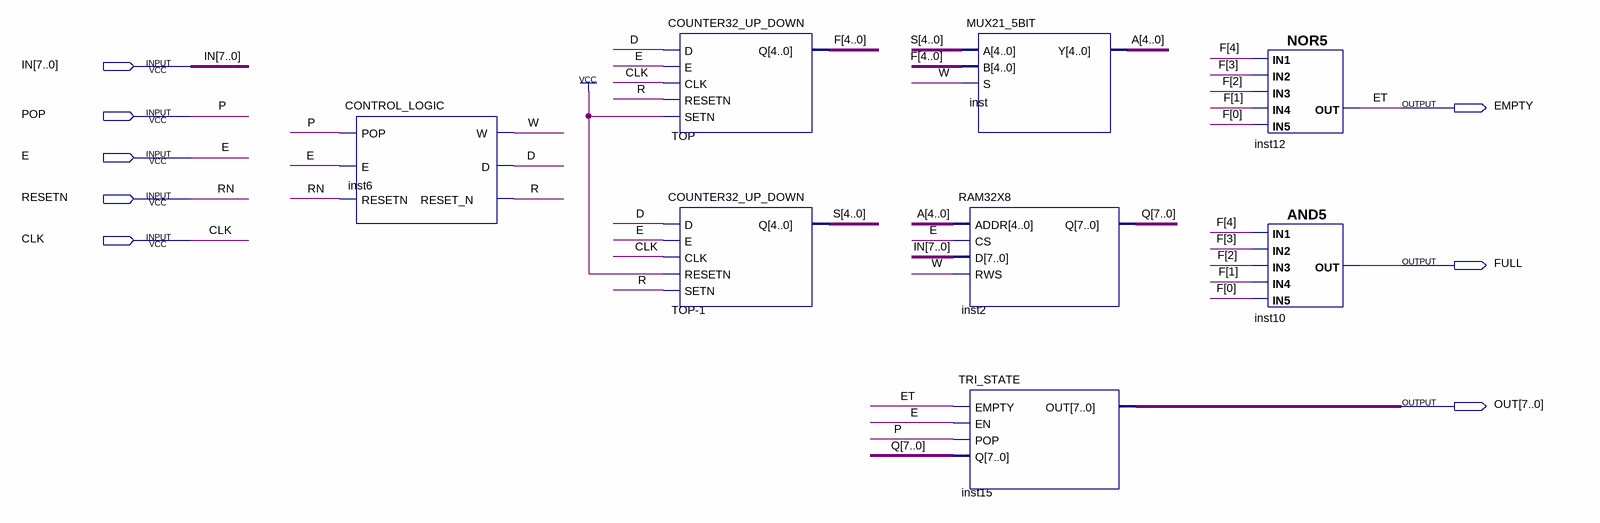
[diagram p0: schematic sheet]
// Quartus schematic STACK.bdf as structural Verilog: 8 symbols, 8 pins
module STACK (
  input  [7:0] IN,
  input  POP,
  input  E,
  input  RESETN,
  input  CLK,
  output EMPTY,
  output FULL,
  output [7:0] OUT
);

  wire D, R, W;
  wire [4:0] A, F, S;
  wire [7:0] Q;

  CONTROL_LOGIC inst6 (.POP(POP), .E(E), .RESETN(RESETN), .W(W), .D(D), .RESET_N(R));
  COUNTER32_UP_DOWN TOP (.D(D), .E(E), .CLK(CLK), .RESETN(R), .SETN(1'b1), .Q(F));
  COUNTER32_UP_DOWN \TOP-1  (.D(D), .E(E), .CLK(CLK), .RESETN(1'b1), .SETN(R), .Q(S));
  MUX21_5BIT inst (.A(S), .B(F), .S(W), .Y(A));
  RAM32X8 inst2 (.ADDR(A), .CS(E), .D(IN), .RWS(W), .Q(Q));
  TRI_STATE inst15 (.EMPTY(EMPTY), .EN(E), .POP(POP), .Q(Q), .OUT(OUT));
  nor inst12 (EMPTY, F[4], F[3], F[2], F[1], F[0]);
  and inst10 (FULL, F[4], F[3], F[2], F[1], F[0]);

  // Other names for the same wires on the sheet: ET = EMPTY; P = POP; RN = RESETN
endmodule
